# Altium schematic sheet PC4_DAC_Cutoff.SchDoc
size 250 x 199 mm
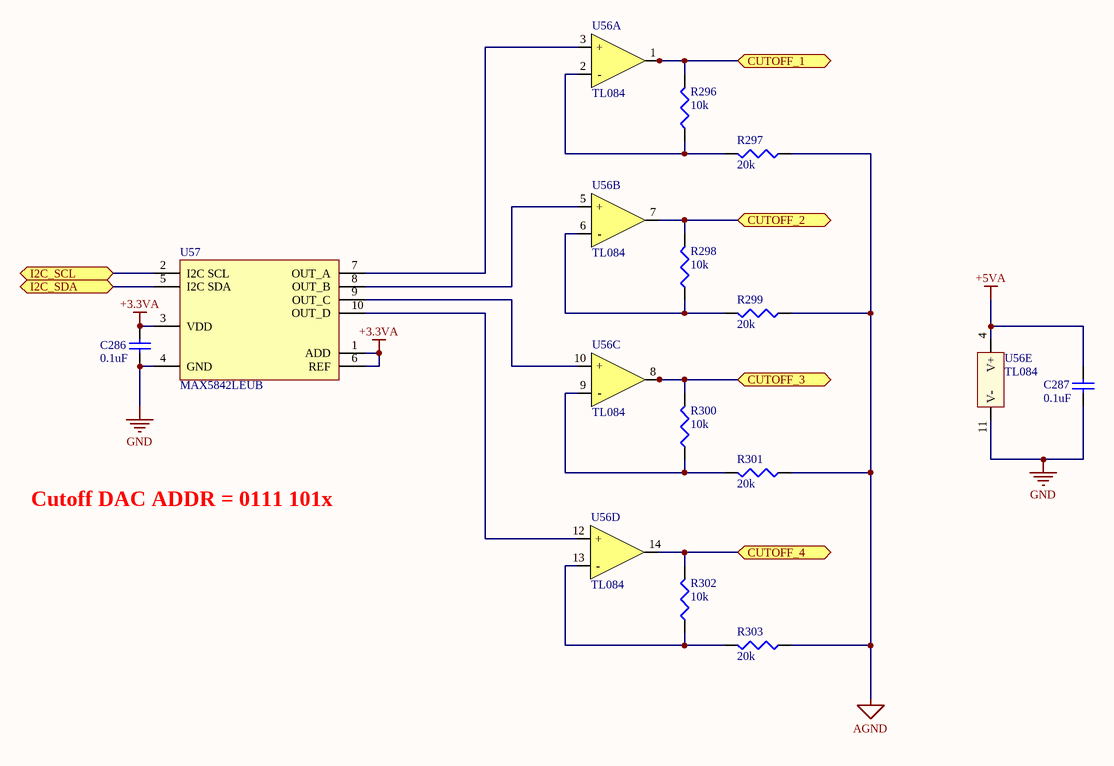
[diagram p0: PC4_DAC_Cutoff.SchDoc]

## Parts
C286  0.1uF  [CAPC1608X08]
C287  0.1uF  [CAPC1608X08]
R296  value 10k  [RESC1608X05]  (hidden comment: Res3)
R297  value 20k  [RESC1608X05]  (hidden comment: Res3)
R298  value 10k  [RESC1608X05]  (hidden comment: Res3)
R299  value 20k  [RESC1608X05]  (hidden comment: Res3)
R300  value 10k  [RESC1608X05]  (hidden comment: Res3)
R301  value 20k  [RESC1608X05]  (hidden comment: Res3)
R302  value 10k  [RESC1608X05]  (hidden comment: Res3)
R303  value 20k  [RESC1608X05]  (hidden comment: Res3)
U56  TL084  [D14-M]  (parts A,B,C,D,E of 5)
U57  MAX5842LEUB  [21-0061L-M]

## Ports
CUTOFF_1, CUTOFF_2, CUTOFF_3, CUTOFF_4, I2C_SCL, I2C_SDA

## Nets
+3.3VA: C286.1 U57.1(ADD) U57.3(VDD) U57.6(REF)
+5VA: C287.1 U56.4(V+)
AGND: R297.2 R299.2 R301.2 R303.2
GND: C286.2 C287.2 U56.11(V-) U57.4(GND)
CUTOFF_1: R296.1 U56.1(OUT) ; port CUTOFF_1
CUTOFF_2: R298.1 U56.7(OUT) ; port CUTOFF_2
CUTOFF_3: R300.1 U56.8(OUT) ; port CUTOFF_3
CUTOFF_4: R302.1 U56.14(OUT) ; port CUTOFF_4
I2C_SCL: U57.2(I2C_SCL) ; port I2C_SCL
I2C_SDA: U57.5(I2C_SDA) ; port I2C_SDA
NetR296_2: R296.2 R297.1 U56.2(-)
NetR298_2: R298.2 R299.1 U56.6(-)
NetR300_2: R300.2 R301.1 U56.9(-)
NetR302_2: R302.2 R303.1 U56.13(-)
NetU56_3: U56.3(+) U57.7(OUT_A)
NetU56_5: U56.5(+) U57.8(OUT_B)
NetU56_10: U56.10(+) U57.9(OUT_C)
NetU56_12: U56.12(+) U57.10(OUT_D)

## Notes on the sheet
- Cutoff DAC ADDR = 0111 101x

## Library data of the parts
C286 C287 = Cap Semi: Capacitor (Semiconductor SIM Model); Fabricant: MURATA; Fournisseur: Farnell; RefFabricant: GRM188F51E104ZA01D; RefFournisseur: 2821272; Value: 0.1uF; Case: 0603 [1608 Metric]; DataSheet: http://www.farnell.com/datasheets/2048672.pdf
R296 R298 R300 R302 = Res3: Resistor; Fabricant: TE CONNECTIVITY; Fournisseur: Farnell; RefFabricant: CPF-A-0603B4K7E1; RefFournisseur: 2483933; Case: 0603 [1608 Metric]; DataSheet: http://www.farnell.com/datasheets/1935020.pdf
R297 R299 R301 R303 = Res3: Resistor; Fabricant: TE CONNECTIVITY; Fournisseur: Farnell; RefFabricant: CPF0603B20KE1; RefFournisseur: 2331029; Case: 0603 [1608 Metric]; DataSheet: http://www.farnell.com/datasheets/2170367.pdf
U56 = TL084: Quad Audio OpAmp; Fabricant: TEXAS INSTRUMENTS; Fournisseur: Farnell; RefFabricant: TL084ID; RefFournisseur: 9593462; DataSheet: http://www.ti.com/lit/ds/symlink/tl084.pdf
U57 = MAX5842LEUB: Quad DAC Package; Fournisseur: Farnell; Fabricant: MAXIM INTEGRATED PRODUCTS; RefFabricant: MAX5842LEUB+; RefFournisseur: 2518696; DataSheet: http://www.farnell.com/datasheets/74794.pdf